# Altium schematic sheet FMB-AB.SchDoc
size A4
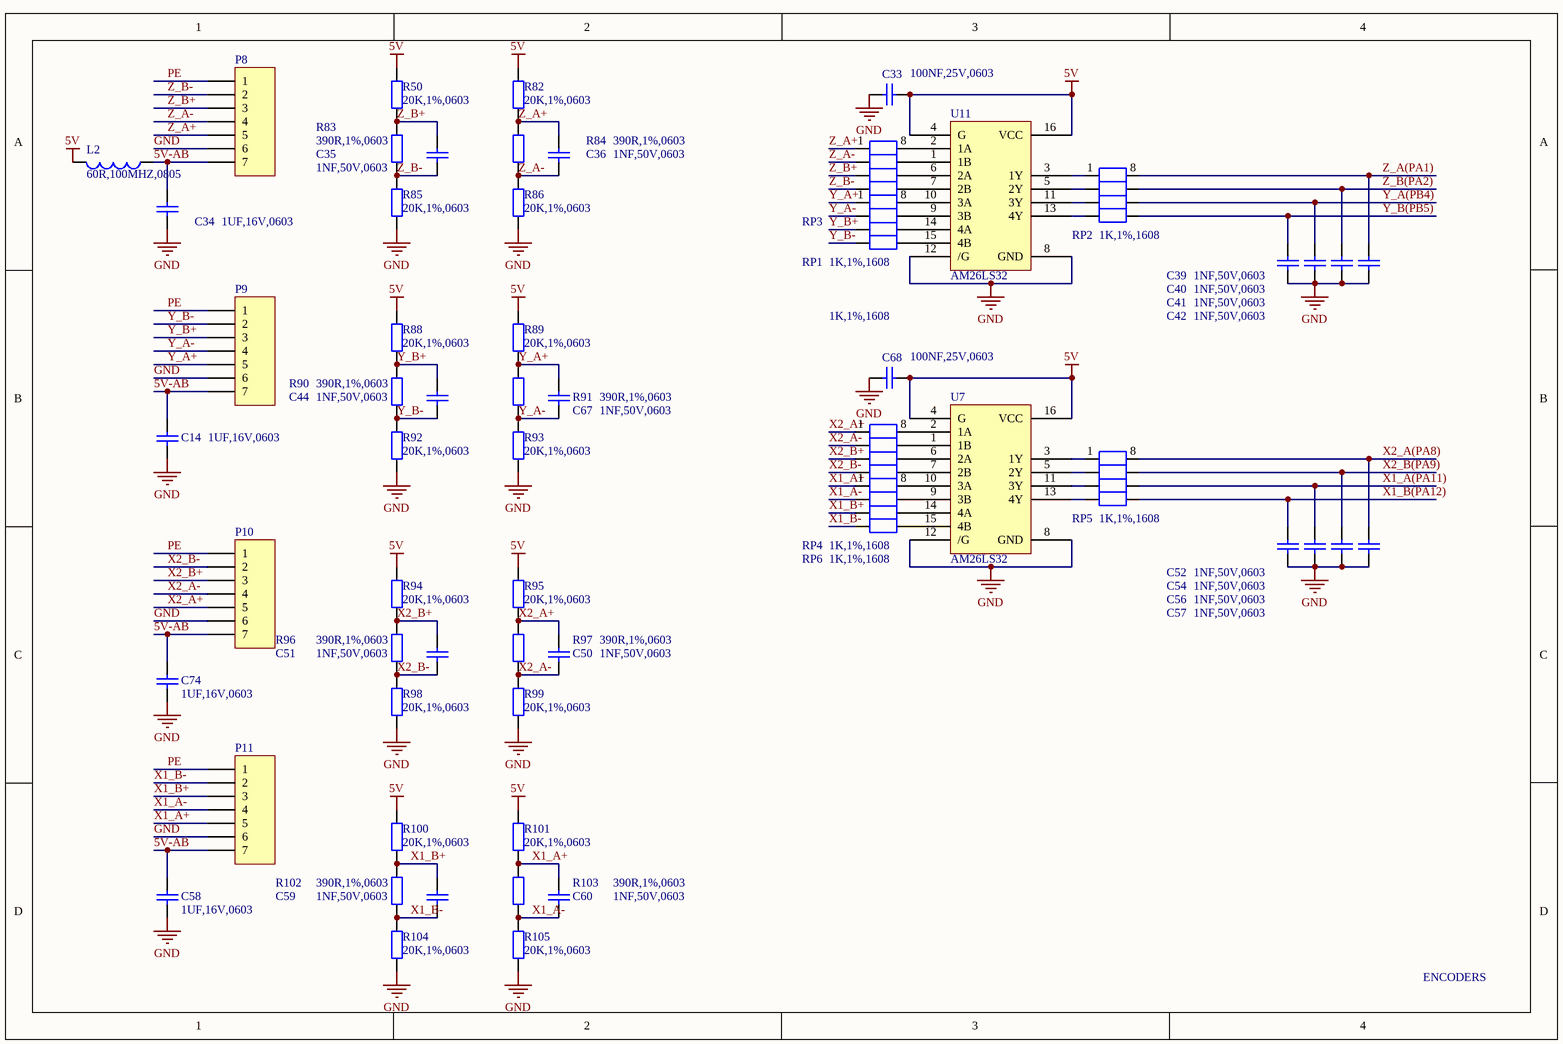
[diagram p0: FMB-AB.SchDoc]

## Parts
C14  1UF,16V,0603  [RC0603]
C33  100NF,25V,0603  [RC0603]
C34  1UF,16V,0603  [RC0603]
C35  1NF,50V,0603  [RC0603]
C36  1NF,50V,0603  [RC0603]
C39  1NF,50V,0603  [RC0603]
C40  1NF,50V,0603  [RC0603]
C41  1NF,50V,0603  [RC0603]
C42  1NF,50V,0603  [RC0603]
C44  1NF,50V,0603  [RC0603]
C50  1NF,50V,0603  [RC0603]
C51  1NF,50V,0603  [RC0603]
C52  1NF,50V,0603  [RC0603]
C54  1NF,50V,0603  [RC0603]
C56  1NF,50V,0603  [RC0603]
C57  1NF,50V,0603  [RC0603]
C58  1UF,16V,0603  [RC0603]
C59  1NF,50V,0603  [RC0603]
C60  1NF,50V,0603  [RC0603]
C67  1NF,50V,0603  [RC0603]
C68  100NF,25V,0603  [RC0603]
C74  1UF,16V,0603  [RC0603]
L2  60R,100MHZ,0805  [RC0805]
P8  Header 7  [DIP-1*7-2.54]  (value not drawn)
P9  Header 7  [DIP-1*7-2.54]  (value not drawn)
P10  Header 7  [DIP-1*7-2.54]  (value not drawn)
P11  Header 7  [DIP-1*7-2.54]  (value not drawn)
R50  20K,1%,0603  [RC0603]
R82  20K,1%,0603  [RC0603]
R83  390R,1%,0603  [RC0603]
R84  390R,1%,0603  [RC0603]
R85  20K,1%,0603  [RC0603]
R86  20K,1%,0603  [RC0603]
R88  20K,1%,0603  [RC0603]
R89  20K,1%,0603  [RC0603]
R90  390R,1%,0603  [RC0603]
R91  390R,1%,0603  [RC0603]
R92  20K,1%,0603  [RC0603]
R93  20K,1%,0603  [RC0603]
R94  20K,1%,0603  [RC0603]
R95  20K,1%,0603  [RC0603]
R96  390R,1%,0603  [RC0603]
R97  390R,1%,0603  [RC0603]
R98  20K,1%,0603  [RC0603]
R99  20K,1%,0603  [RC0603]
R100  20K,1%,0603  [RC0603]
R101  20K,1%,0603  [RC0603]
R102  390R,1%,0603  [RC0603]
R103  390R,1%,0603  [RC0603]
R104  20K,1%,0603  [RC0603]
R105  20K,1%,0603  [RC0603]
RP1  1K,1%,1608  [RP1608]
RP2  1K,1%,1608  [RP1608]
RP3  1K,1%,1608  [RP1608]
RP4  1K,1%,1608  [RP1608]
RP5  1K,1%,1608  [RP1608]
RP6  1K,1%,1608  [RP1608]
U7  AM26LS32  [SO-16-H]
U11  AM26LS32  [SO-16-H]

## Nets
5V: C33.1 C68.1 L2.2 R50.1 R82.1 R88.1 R89.1 R94.1 R95.1 R100.1 R101.1 U7.4(G) U7.16(VCC) U11.4(G) U11.16(VCC)
GND: C14.2 C33.2 C34.2 C39.1 C40.1 C41.1 C42.1 C52.1 C54.1 C56.1 C57.1 C58.2 C68.2 C74.2 P8.6 P9.6 P10.6 P11.6 R85.2 R86.2 R92.2 R93.2 R98.2 R99.2 R104.2 R105.2 U7.8(GND) U7.12(/G) U11.8(GND) U11.12(/G)
5V-AB: C14.1 C34.1 C58.1 C74.1 L2.1 P8.7 P9.7 P10.7 P11.7
PE: P8.1 P9.1 P10.1 P11.1
X1_A(PA11): C52.2 RP5.6
X1_A+: C60.2 P11.5 R101.2 R103.1 RP6.1
X1_A-: C60.1 P11.4 R103.2 R105.1 RP6.2
X1_B(PA12): C54.2 RP5.5
X1_B+: C59.2 P11.3 R100.2 R102.1 RP6.3
X1_B-: C59.1 P11.2 R102.2 R104.1 RP6.4
X2_A(PA8): C57.2 RP5.8
X2_A+: C50.2 P10.5 R95.2 R97.1 RP4.1
X2_A-: C50.1 P10.4 R97.2 R99.1 RP4.2
X2_B(PA9): C56.2 RP5.7
X2_B+: C51.2 P10.3 R94.2 R96.1 RP4.3
X2_B-: C51.1 P10.2 R96.2 R98.1 RP4.4
Y_A(PB4): C39.2 RP2.6
Y_A+: C67.2 P9.5 R89.2 R91.1 RP3.1
Y_A-: C67.1 P9.4 R91.2 R93.1 RP3.2
Y_B(PB5): C40.2 RP2.5
Y_B+: C44.2 P9.3 R88.2 R90.1 RP3.3
Y_B-: C44.1 P9.2 R90.2 R92.1 RP3.4
Z_A(PA1): C42.2 RP2.8
Z_A+: C36.2 P8.5 R82.2 R84.1 RP1.1
Z_A-: C36.1 P8.4 R84.2 R86.1 RP1.2
Z_B(PA2): C41.2 RP2.7
Z_B+: C35.2 P8.3 R50.2 R83.1 RP1.3
Z_B-: C35.1 P8.2 R83.2 R85.1 RP1.4
NetRP1_5: RP1.5 U11.7(2B)
NetRP1_6: RP1.6 U11.6(2A)
NetRP1_7: RP1.7 U11.1(1B)
NetRP1_8: RP1.8 U11.2(1A)
NetRP2_1: RP2.1 U11.3(1Y)
NetRP2_2: RP2.2 U11.5(2Y)
NetRP2_3: RP2.3 U11.11(3Y)
NetRP2_4: RP2.4 U11.13(4Y)
NetRP3_5: RP3.5 U11.15(4B)
NetRP3_6: RP3.6 U11.14(4A)
NetRP3_7: RP3.7 U11.9(3B)
NetRP3_8: RP3.8 U11.10(3A)
NetRP4_5: RP4.5 U7.7(2B)
NetRP4_6: RP4.6 U7.6(2A)
NetRP4_7: RP4.7 U7.1(1B)
NetRP4_8: RP4.8 U7.2(1A)
NetRP5_1: RP5.1 U7.3(1Y)
NetRP5_2: RP5.2 U7.5(2Y)
NetRP5_3: RP5.3 U7.11(3Y)
NetRP5_4: RP5.4 U7.13(4Y)
NetRP6_5: RP6.5 U7.15(4B)
NetRP6_6: RP6.6 U7.14(4A)
NetRP6_7: RP6.7 U7.9(3B)
NetRP6_8: RP6.8 U7.10(3A)

## Notes on the sheet
- ENCODERS

## Library data of the parts
C14 C33-C36 C39-C42 C44 C50-C52 C54 C56-C60 C67 C68 C74 = Cap: Capacitor; Value: 100pF; Published: 8-Jun-2000; LatestRevisionDate: 17-Jul-2002; LatestRevisionNote: Re-released for DXP Platform.; PackageReference: RAD-0.3; Publisher: Altium Limited; PackageDescription: Radial Cap, Thru-Hole; 2 Leads; 0.3 in Pin Spacing
L2 = Inductor: Code_IEC: 1005; Value: 10mH; Published: 8-Jun-2000; LatestRevisionDate: 29-May-2009; LatestRevisionNote: IPC-7351 Footprint Added.; PackageReference: 0402-A; Publisher: Altium Limited; PackageDescription: Chip Inductor; Code_JEITA: 0402
P8-P11 = Header 7: Header, 7-Pin; LatestRevisionDate: 17-Jul-2002; LatestRevisionNote: Re-released for DXP Platform.; Publisher: Altium Limited
R50 R82-R86 R88-R105 = Res2: Resistor; Value: 1K; Published: 8-Jun-2000; LatestRevisionDate: 17-Jul-2002; LatestRevisionNote: Re-released for DXP Platform.; PackageReference: AXIAL-0.4; Publisher: Altium Limited; PackageDescription: Axial Device, Thru-Hole; 2 Leads; 0.4 in Pin Spacing
RP1-RP6 = RP1608-1